# EAGLE design breadboard-E03 (EAGLE 7.4.0)
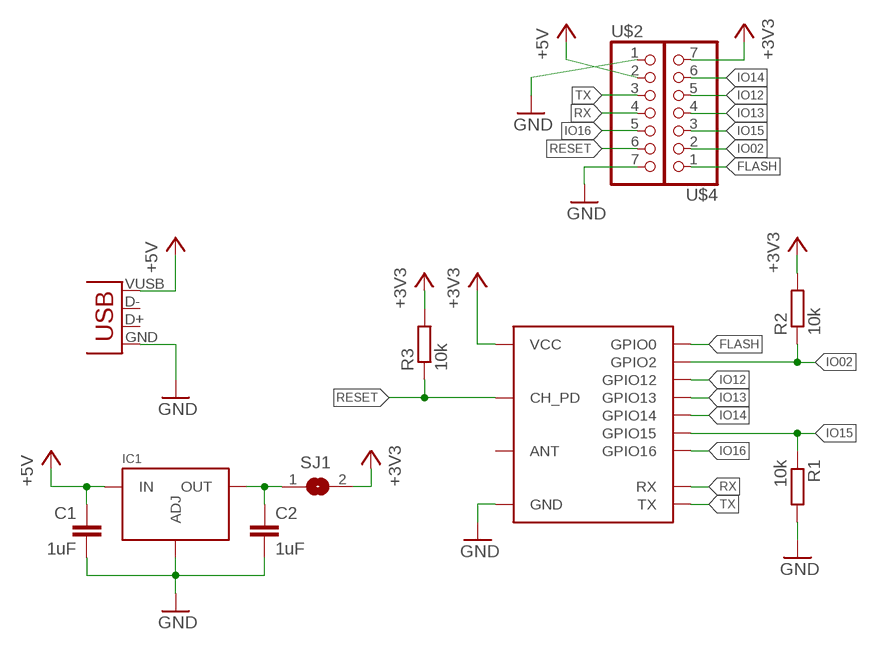
[diagram p0: schematic, sheet 1]

## Parts
C1  1uF  C-EUC0805  [C0805]
C2  1uF  C-EUC0805  [C0805]
CON1  USBMICRO-NO_CENTER  [USB-MICRO-SMD-NO_CENTER]
IC1  REGULATOR-TLV1117SOT223  [SOT223]
R1  10k  R-EU_R0603  [R0603]
R2  10k  R-EU_R0603  [R0603]
R3  10k  R-EU_R0603  [R0603]
SJ1  SJ  [SJ]
U$1  ESP8266-03  [ESP8266-ESP-03]
U$2  GENERIC-1X7  [PINHEADER-100MIL-1X7]
U$4  GENERIC-1X7  [PINHEADER-100MIL-1X7]

## Nets
+3V3: R2.2 R3.2 SJ1.2 U$1.P$8(VCC) U$4.7
+5V: C1.1 CON1.VUSB(VBUS) IC1.3(IN) U$2.2
FLASH: U$1.P$14(GPIO0) U$4.1
GND: C1.2 C2.2 CON1.GND IC1.1(ADJ) R1.2 U$1.P$1(GND) U$2.1 U$2.7
IO02: R2.1 U$1.P$13(GPIO2) U$4.2
IO12: U$1.P$10(GPIO12) U$4.5
IO13: U$1.P$11(GPIO13) U$4.4
IO14: U$1.P$9(GPIO14) U$4.6
IO15: R1.1 U$1.P$12(GPIO15) U$4.3
IO16: U$1.P$5(GPIO16) U$2.5
N$1: C2.1 IC1.2(OUT) IC1.4(OUT) SJ1.1
RESET: R3.1 U$1.P$6(CH_PD) U$2.6
RX: U$1.P$4(RX) U$2.4
TX: U$1.P$3(TX) U$2.3
Unconnected: CON1.D+ CON1.D- U$1.P$7(ANT)

## Library data of the parts
C1 C2 = p.peter-rcl:C-EU: CAPACITOR, European symbol
CON1 = p.peter-connectors:USB
IC1 = p.peter-regulators:REGULATOR-TLV1117
R1-R3 = p.peter-rcl:R-EU_: RESISTOR, European symbol
SJ1 = jumper:SJ: SMD solder JUMPER
U$1 = p.peter-periphery:ESP8266-03
U$2 U$4 = p.peter-connectors:GENERIC-1X7

## Board
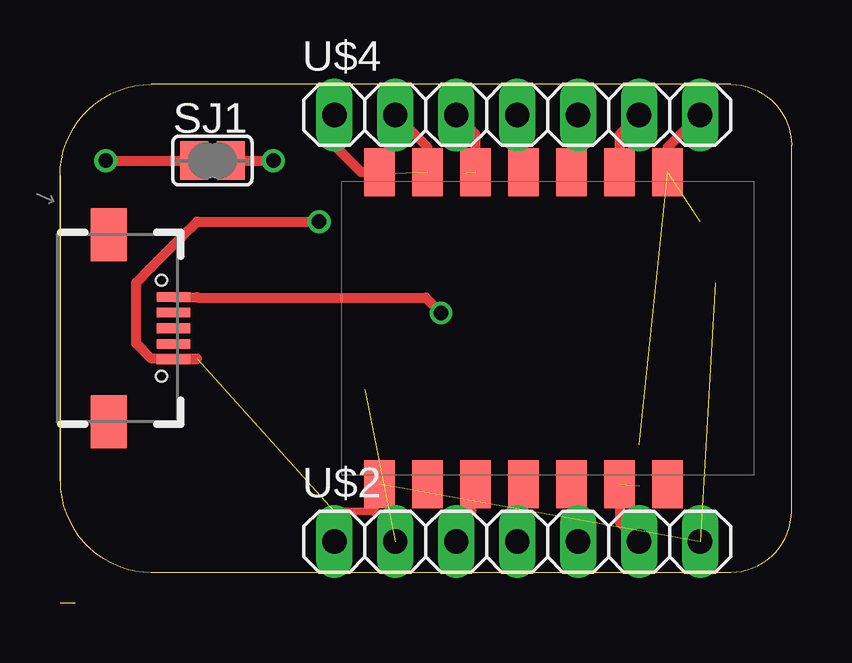
[diagram p1: board, top side]
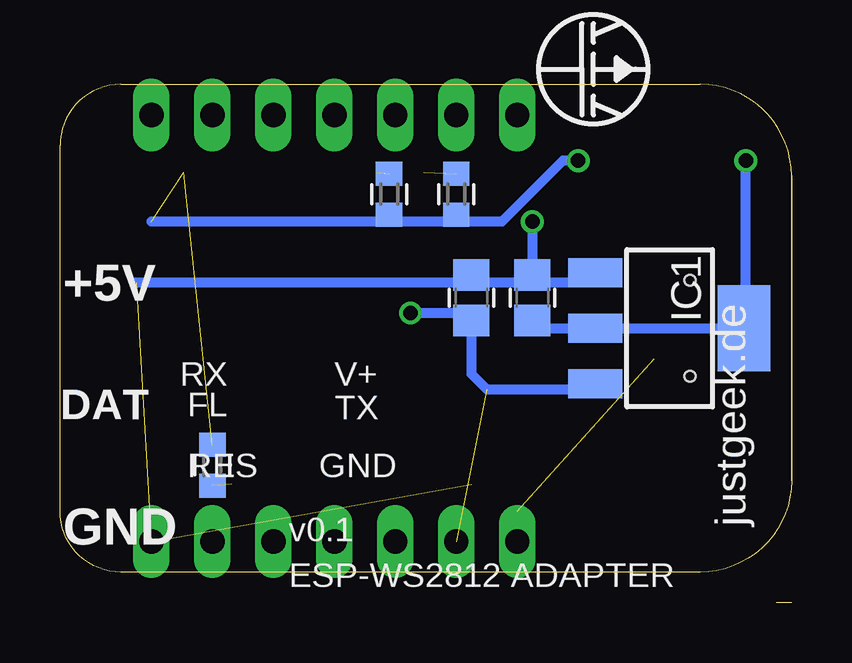
[diagram p2: board, bottom side, seen from below]

Size 30.48 x 21.59 mm. Coordinates in mm from the lower left corner, seen from the top.
Outline: 0,5.08 0,11.43 0,17.78
Outline: 0,17.78 arc-90 3.81,21.59 27.94,21.59 arc-90 30.48,19.05 30.48,3.81 arc-90 27.94,1.27 3.81,1.27 arc-90 0,5.08
Outline: 0,17.78 0,5.08
Outline: 0,0 0.64,0
Copper layers (1*16): Top 0.0356mm / dielectric 1.5011mm / Bottom 0.0356mm
Design rules "oshpark": minimum track width 6mil, minimum drill 13mil, track to track 6mil, track to pad 6mil, pad to pad 6mil, via to via 6mil, smd to smd 6mil, copper to edge 15mil, drill to drill 6mil, minimum pad ring 7mil, minimum via ring 7mil, stop-mask expansion 4mil, vias tented up to drill 4.1mm, thermal gap 10mil

### Footprints (pad centres in the part's own frame; a part is rotated, then mirrored left to right if it is on the bottom)
C0805 = smd 1.3 x 1.5: 1 -0.95,0; 2 0.95,0
USB-MICRO-SMD-NO_CENTER = smd 1.4 x 0.4: D+ 1.43,0; D- 1.43,0.65; GND 1.43,-1.3; ID 1.43,-0.65; VUSB 1.43,1.3 | smd 1.5 x 2.2: P$1 -1.27,3.9; P$2 -1.27,-3.9 | hole 0.45: 0.93,2; 0.93,-2
SOT223 = smd 1.219 x 2.235: 1 -2.311,-3.099; 2 0,-3.099; 3 2.311,-3.099 | smd 3.6 x 2.2: 4 0,3.099
R0603 = smd 1 x 1.1: 1 -0.85,0; 2 0.85,0
SJ = smd 1.168 x 1.6: 1 -0.762,0; 2 0.762,0
ESP8266-ESP-03 = smd 1.27 x 2: P$1 7,6.5; P$2 5,6.5; P$3 3,6.5; P$4 1,6.5; P$5 -1,6.5; P$6 -3,6.5; P$7 -5,6.5; P$8 -5,-6.5; P$9 -3,-6.5; P$10 -1,-6.5; P$11 1,-6.5; P$12 3,-6.5; P$13 5,-6.5; P$14 7,-6.5
PINHEADER-100MIL-1X7 = drill 1.016 long: 1 -7.62,0; 2 -5.08,0; 3 -2.54,0; 4 0,0; 5 2.54,0; 6 5.08,0; 7 7.62,0

### Placement (x,y rotation side)
C1  13.33,12.7 90 bottom
C2  10.79,12.7 90 bottom
CON1  3.3,11.43 0 top
IC1  5.08,11.43 270 bottom
R1  16.76,17.02 270 bottom
R2  13.97,17.02 270 bottom
R3  24.13,5.71 90 bottom
SJ1  6.35,18.41 0 top
U$1  20.32,11.43 180 top
U$2  19.05,2.54 0 top
U$3  [LOGO-JUSTGEEK-XS]  8.26,22.23 90 bottom
U$4  19.05,20.32 0 top

### Tracks (layer width: path | path; a pad name or v marks a point on that pad's centre or on a via)
+3V3  (via drill 0.6)  (2 unrouted)
  Top 0.406: U$1.P$8 25.32,18.97 U$4.7 | SJ1.2 v8.89,18.41
  Bottom 0.406: v8.89,18.41 9.53,18.41 12.06,15.88 13.68,15.88 R2.2 13.97,15.88 26.67,15.88
+5V  (via drill 0.6)  (1 unrouted)
  Top 0.406: CON1.VUSB 5.71,12.73 5.71,12.7 15.24,12.7 v15.88,12.06
  Bottom 0.406: IC1.3 8.41,8.89 12.7,8.89 13.33,9.53 C1.1 13.65,12.06 v15.88,12.06
FLASH
  Top 0.406: U$1.P$14 12.55,17.93 12.06,18.41 11.43,19.05 U$4.1
GND  (via drill 0.6)  (3 unrouted)
  Top 0.305: 11.43,3.81 12.7,3.81 13.08,3.81
  Top 0.406: U$2.1 11.43,3.81 | 13.08,3.81 13.08,4.69 U$1.P$1 | CON1.GND 5.68,10.13 5.71,10.16 3.81,10.16 3.17,10.79 3.17,13.34 3.81,13.97 5.08,15.24 5.71,15.88 v10.79,15.88
  Bottom 0.406: IC1.1 8.18,13.41 8.26,13.34 10.48,13.34 C2.2 | v10.79,15.88 C2.2 | C2.2 10.79,13.34 13.02,13.34 C1.2 13.33,13.34 17.15,13.34 27.31,13.34
IO02  (1 unrouted)
  Top 0.406: U$1.P$13 15.32,18.97 U$4.2
IO12
  Top 0.406: U$1.P$10 21.32,18.14 21.59,18.41 U$4.5
IO13
  Top 0.406: U$1.P$11 19.32,18.14 19.05,18.41 U$4.4
IO14
  Top 0.406: U$1.P$9 23.32,19.51 U$4.6
IO15  (1 unrouted)
  Top 0.406: U$4.3 17.15,19.68 17.32,19.51 U$1.P$12
IO16
  Top 0.406: U$1.P$5 21.32,4.71 21.59,4.45 U$2.5
N$1  (via drill 0.6)
  Top 0.406: v1.91,18.41 SJ1.1
  Bottom 0.406: C2.1 10.79,11.43 IC1.2 IC1.4 1.98,11.99 1.91,12.06 v1.91,18.41
RESET  (1 unrouted)
  Top 0.406: U$1.P$6 23.32,3.35 U$2.6
RX
  Top 0.406: U$1.P$4 19.32,4.71 19.05,4.45 U$2.4
TX
  Top 0.406: U$2.3 16.51,3.17 17.15,3.81 17.15,4.75 U$1.P$3

### Text on the board
bPlace: +5V | V+ | RX | TX | FL | DAT | GND | RES | justgeek.de | v0.1 | GND | ESP-WS2812 ADAPTER